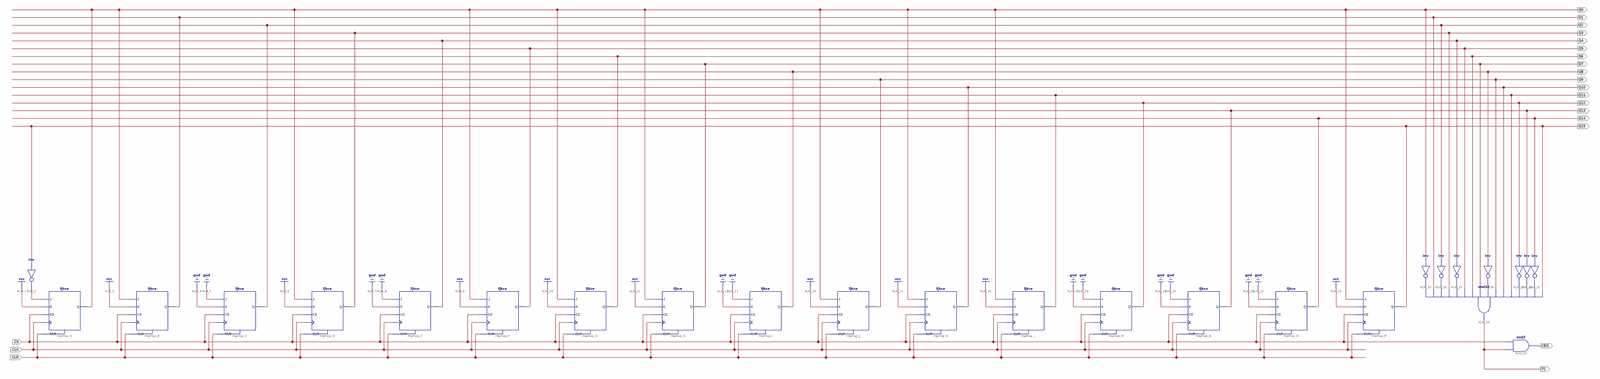
[diagram p0: schematic sheet 1, whole]
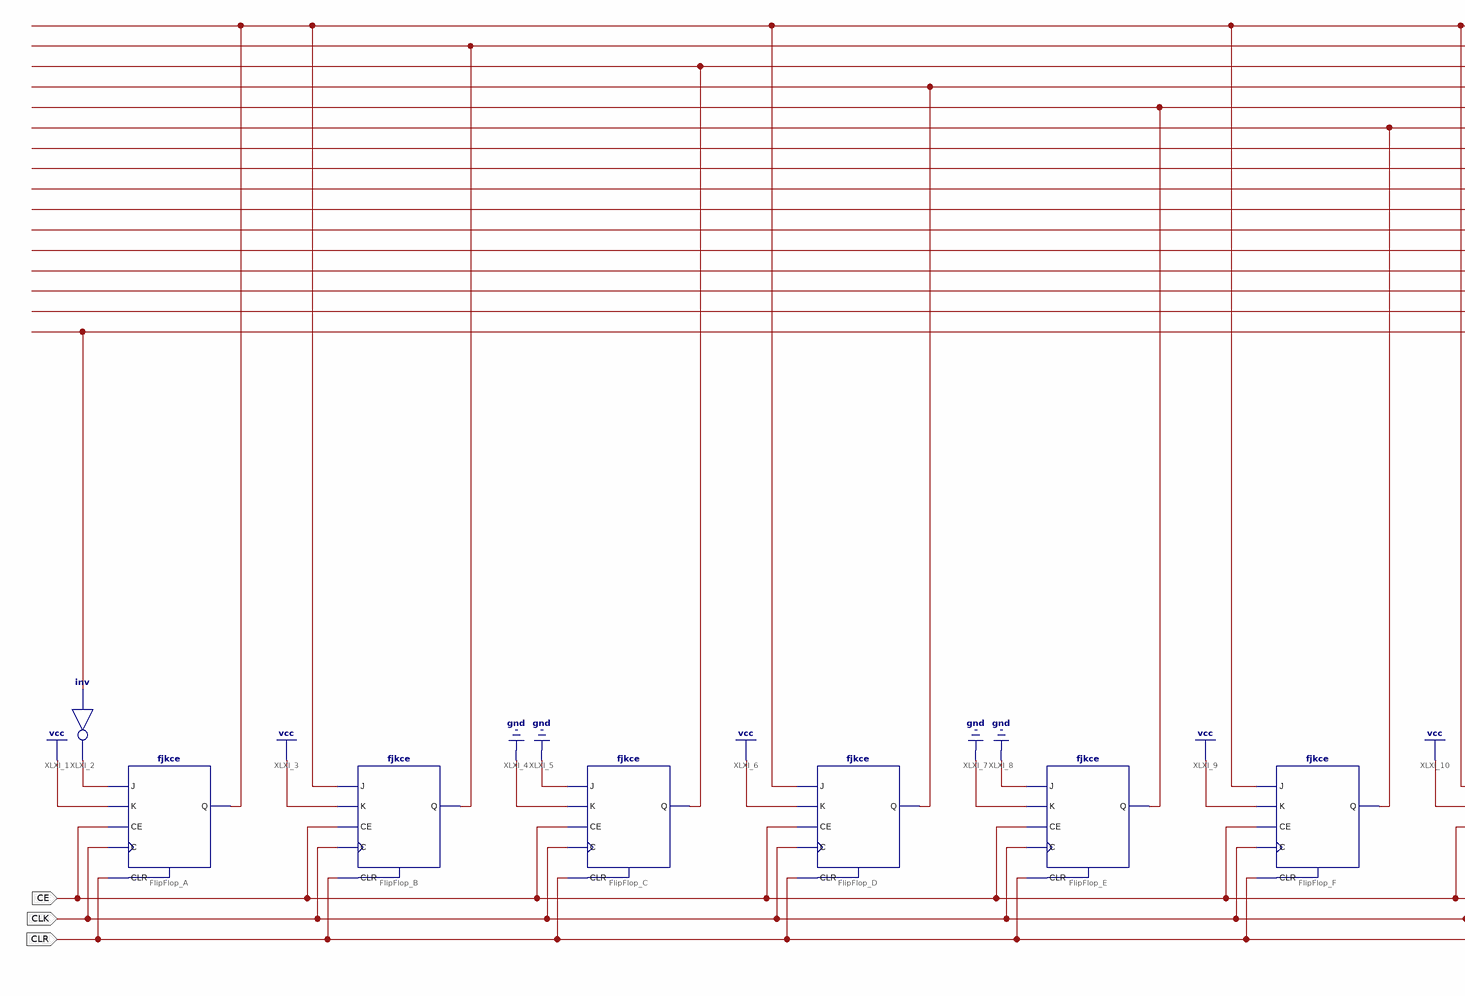
[diagram p1: schematic sheet 1, left part]
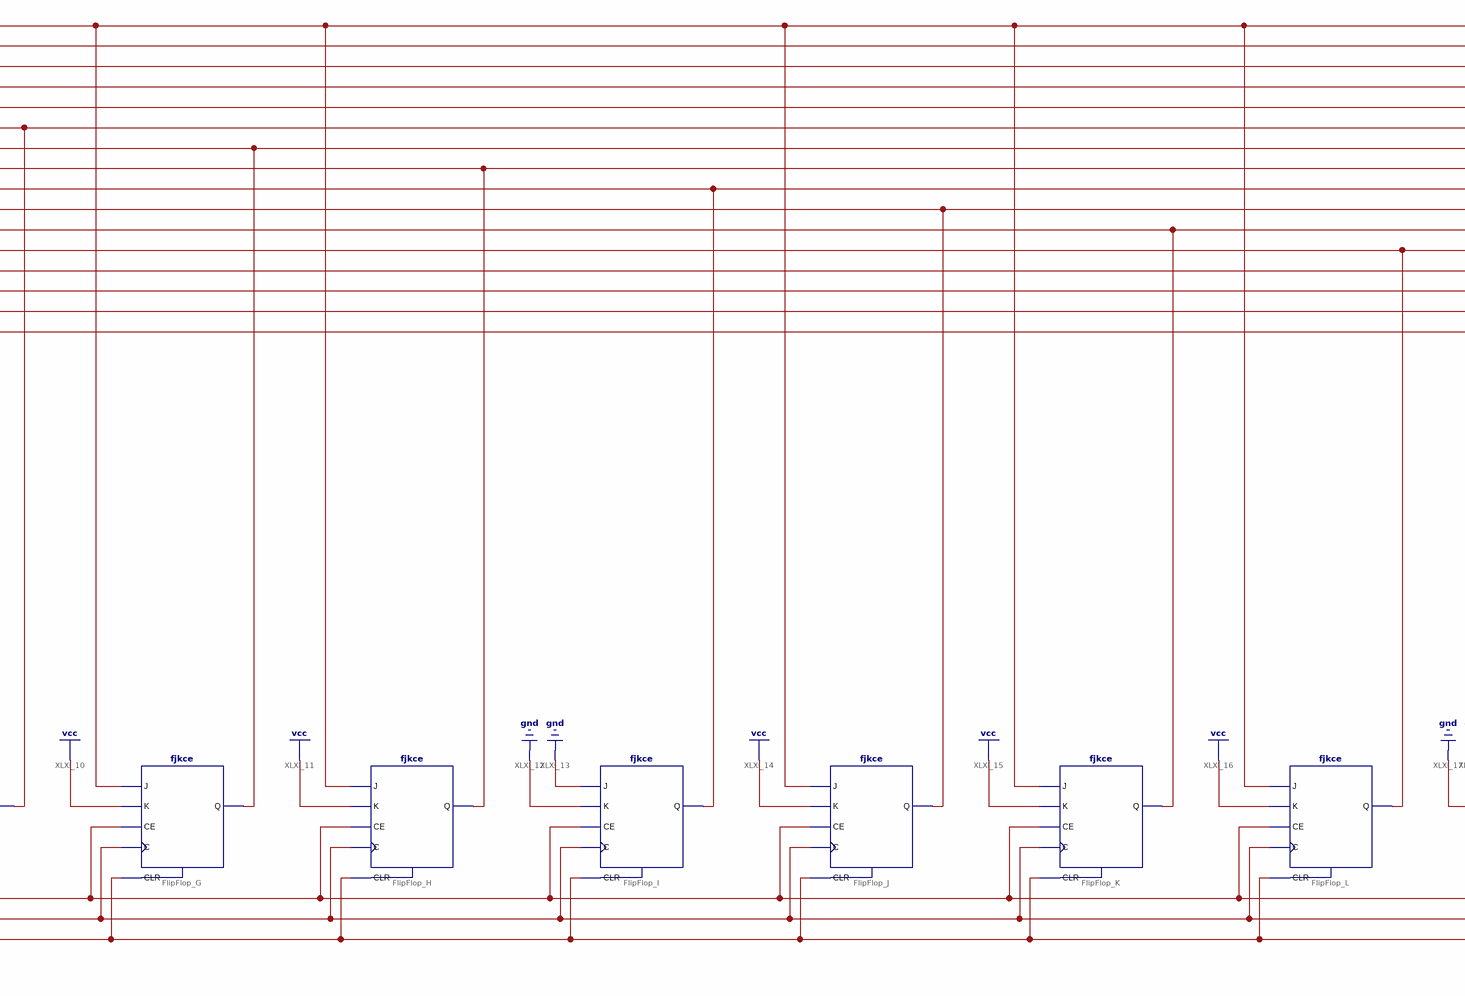
[diagram p2: schematic sheet 1, centre part]
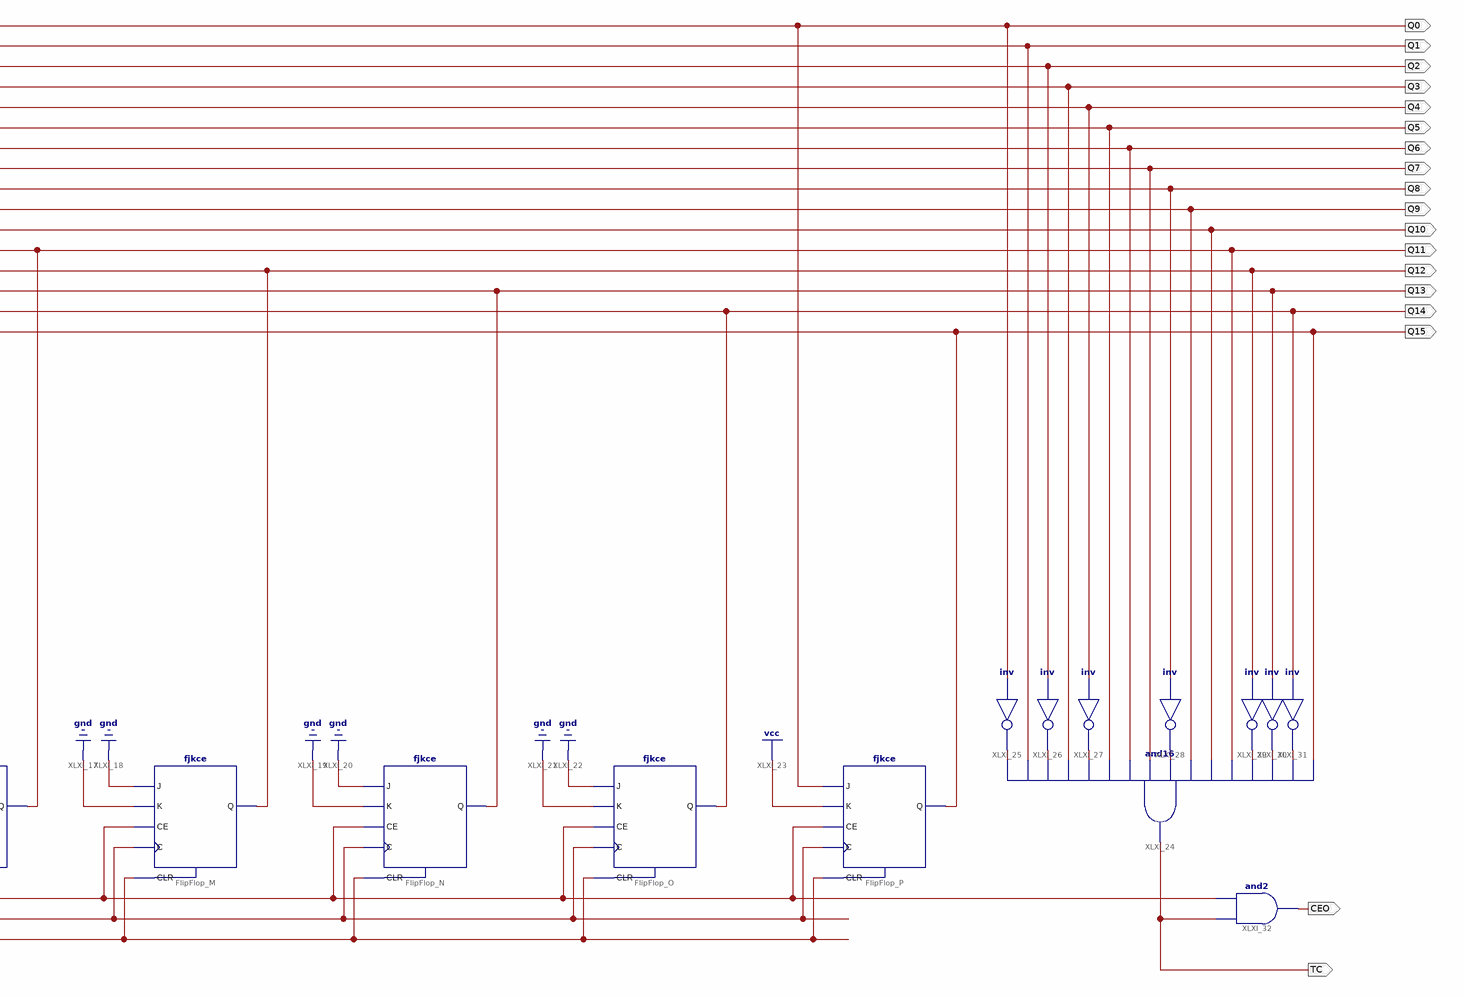
[diagram p3: schematic sheet 1, right part]
// Xilinx ISE schematic counter.sch (spartan6) as structural Verilog: 26 symbols, 21 ports
module counter (
  input  CE,
  input  CLK,
  input  CLR,
  output CEO,
  output TC,
  output Q0,
  output Q1,
  output Q2,
  output Q3,
  output Q4,
  output Q5,
  output Q6,
  output Q7,
  output Q8,
  output Q9,
  output Q10,
  output Q11,
  output Q12,
  output Q13,
  output Q14,
  output Q15
);

  wire XLXN_2, XLXN_24, XLXN_25, XLXN_26, XLXN_27, XLXN_28, XLXN_29, XLXN_30;

  not XLXI_2 (XLXN_2, Q15);
  fjkce FlipFlop_A (.C(CLK), .CE(CE), .CLR(CLR), .J(XLXN_2), .K(1'b1), .Q(Q0));
  fjkce FlipFlop_B (.C(CLK), .CE(CE), .CLR(CLR), .J(Q0), .K(1'b1), .Q(Q1));
  fjkce FlipFlop_C (.C(CLK), .CE(CE), .CLR(CLR), .J(1'b0), .K(1'b0), .Q(Q2));
  fjkce FlipFlop_D (.C(CLK), .CE(CE), .CLR(CLR), .J(Q0), .K(1'b1), .Q(Q3));
  fjkce FlipFlop_E (.C(CLK), .CE(CE), .CLR(CLR), .J(1'b0), .K(1'b0), .Q(Q4));
  fjkce FlipFlop_F (.C(CLK), .CE(CE), .CLR(CLR), .J(Q0), .K(1'b1), .Q(Q5));
  fjkce FlipFlop_G (.C(CLK), .CE(CE), .CLR(CLR), .J(Q0), .K(1'b1), .Q(Q6));
  fjkce FlipFlop_H (.C(CLK), .CE(CE), .CLR(CLR), .J(Q0), .K(1'b1), .Q(Q7));
  fjkce FlipFlop_I (.C(CLK), .CE(CE), .CLR(CLR), .J(1'b0), .K(1'b0), .Q(Q8));
  fjkce FlipFlop_J (.C(CLK), .CE(CE), .CLR(CLR), .J(Q0), .K(1'b1), .Q(Q9));
  fjkce FlipFlop_K (.C(CLK), .CE(CE), .CLR(CLR), .J(Q0), .K(1'b1), .Q(Q10));
  fjkce FlipFlop_L (.C(CLK), .CE(CE), .CLR(CLR), .J(Q0), .K(1'b1), .Q(Q11));
  fjkce FlipFlop_M (.C(CLK), .CE(CE), .CLR(CLR), .J(1'b0), .K(1'b0), .Q(Q12));
  fjkce FlipFlop_N (.C(CLK), .CE(CE), .CLR(CLR), .J(1'b0), .K(1'b0), .Q(Q13));
  fjkce FlipFlop_O (.C(CLK), .CE(CE), .CLR(CLR), .J(1'b0), .K(1'b0), .Q(Q14));
  fjkce FlipFlop_P (.C(CLK), .CE(CE), .CLR(CLR), .J(Q0), .K(1'b1), .Q(Q15));
  and XLXI_24 (TC, XLXN_24, Q1, XLXN_25, Q3, XLXN_26, Q5, Q6, Q7, XLXN_27, Q9, Q10, Q11, XLXN_28, XLXN_29, XLXN_30, Q15);
  not XLXI_25 (XLXN_24, Q0);
  not XLXI_26 (XLXN_25, Q2);
  not XLXI_27 (XLXN_26, Q4);
  not XLXI_28 (XLXN_27, Q8);
  not XLXI_29 (XLXN_28, Q12);
  not XLXI_30 (XLXN_29, Q13);
  not XLXI_31 (XLXN_30, Q14);
  and XLXI_32 (CEO, CE, TC);
endmodule
